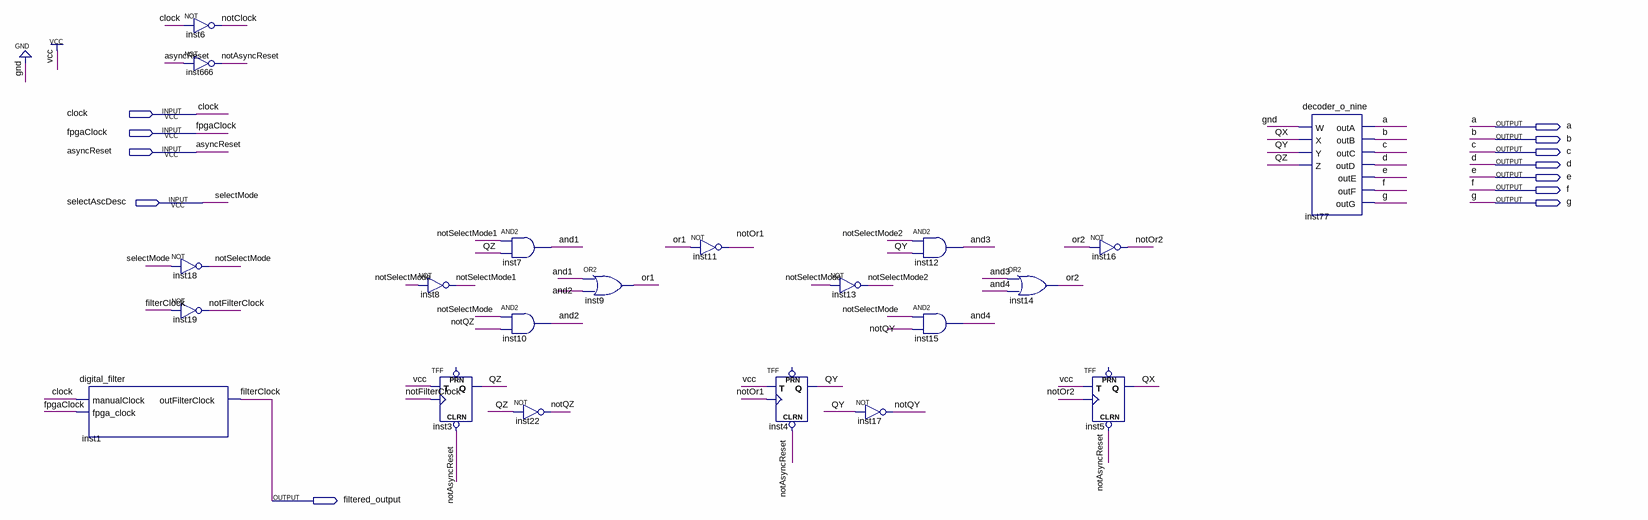
[diagram p0: schematic sheet]
// Quartus schematic debouncer.bdf as structural Verilog: 21 symbols, 12 pins
module debouncer (
  input  clock,
  input  fpgaClock,
  input  asyncReset,
  input  selectAscDesc,
  output a,
  output b,
  output c,
  output d,
  output e,
  output f,
  output g,
  output filtered_output
);

  wire and1, and2, and3, and4, notAsyncReset, notClock, notFilterClock, notOr1, notOr2, notQY, notQZ,
       notSelectMode, notSelectMode1, notSelectMode2, or1, or2, QX, QY, QZ;

  digital_filter inst1 (.manualClock(clock), .fpga_clock(fpgaClock), .outFilterClock(filtered_output));
  not inst6 (notClock, clock);
  not inst666 (notAsyncReset, asyncReset);
  not inst18 (notSelectMode, selectAscDesc);
  not inst19 (notFilterClock, filtered_output);
  not inst8 (notSelectMode1, notSelectMode);
  TFF inst3 (.CLRN(notAsyncReset), .T(1'b1), .CLK(notFilterClock), .Q(QZ));  // open: PRN
  and inst7 (and1, notSelectMode1, QZ);
  and inst10 (and2, notSelectMode, notQZ);
  not inst22 (notQZ, QZ);
  or inst9 (or1, and1, and2);
  not inst11 (notOr1, or1);
  TFF inst4 (.CLRN(notAsyncReset), .T(1'b1), .CLK(notOr1), .Q(QY));  // open: PRN
  not inst13 (notSelectMode2, notSelectMode);
  not inst17 (notQY, QY);
  and inst12 (and3, notSelectMode2, QY);
  and inst15 (and4, notSelectMode, notQY);
  or inst14 (or2, and3, and4);
  not inst16 (notOr2, or2);
  TFF inst5 (.CLRN(notAsyncReset), .T(1'b1), .CLK(notOr2), .Q(QX));  // open: PRN
  decoder_o_nine inst77 (
    .W(1'b0), .X(QX), .Y(QY), .Z(QZ), .outA(a), .outB(b), .outC(c), .outD(d), .outE(e), .outF(f), .outG(g));

  // Other names for the same wires on the sheet: filterClock = filtered_output; selectMode = selectAscDesc
endmodule
